# Altium schematic sheet 29-USB 2.0 INTERFACE.SchDoc
size 513 x 386 mm
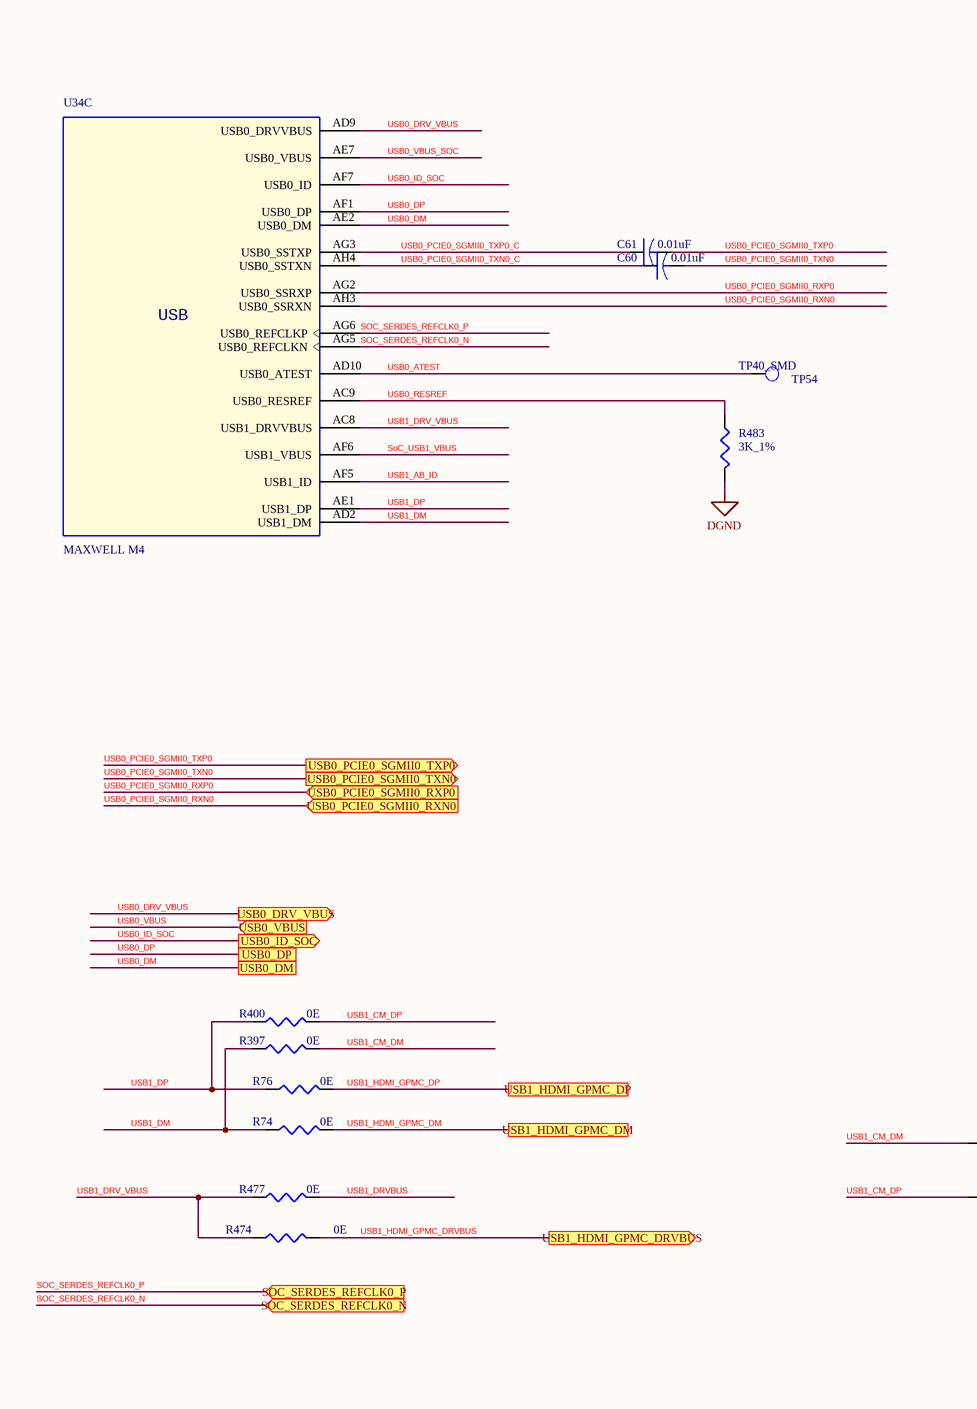
[diagram p0: 29-USB 2.0 INTERFACE.SchDoc, left]
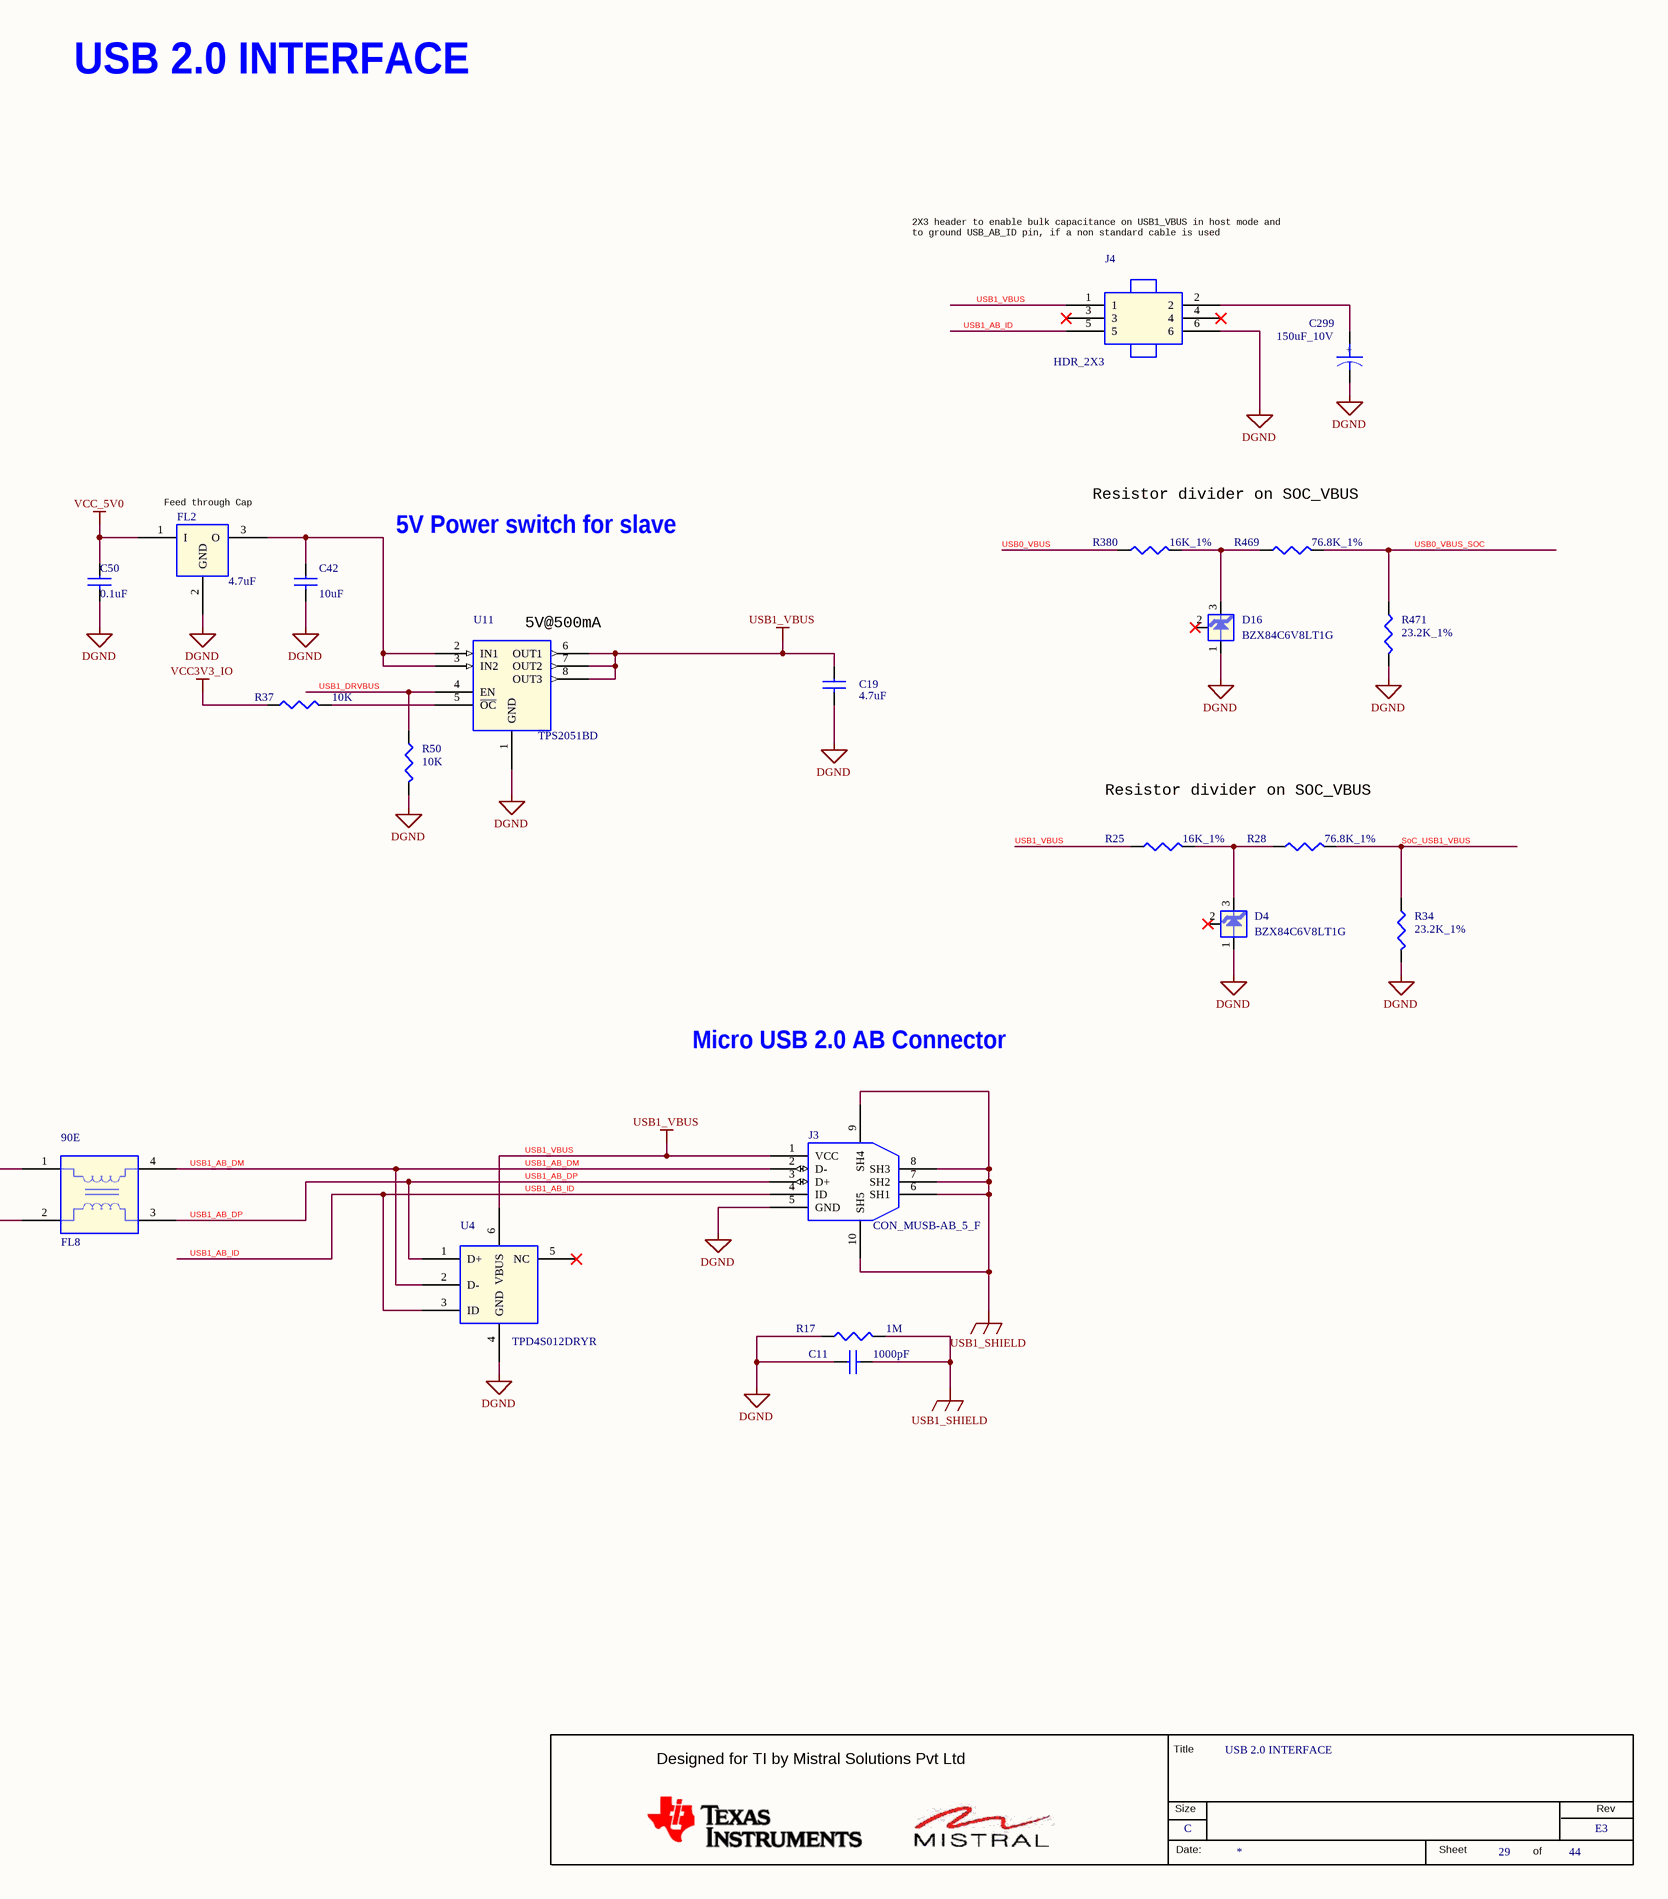
[diagram p1: 29-USB 2.0 INTERFACE.SchDoc, right]

## Parts
*  RevCode: E3  Title: USB 2.0 INTERFACE  Page Size: C  Page Number: 29  Page Count: 44  (hidden comment: MISTRAL_TITLEBLK_CSIZE)  (graphical)
C11  1000pF  [CAP1206]
C19  4.7uF  [CAP0402_0-75]
C42  10uF  [CAP0603_1]
C50  0.1uF  [CAP0201_0-5]
C60  0.01uF  [CAP0402_0-75]
C61  0.01uF  [CAP0402_0-75]
C299  150uF_10V  [CAPT7343D_3-25]
D4  BZX84C6V8LT1G  [SOT23-123_1-2]
D16  BZX84C6V8LT1G  [SOT23-123_1-2]
FL2  4.7uF  [EMIFIL_NFM21P_0805_1]
FL8  90E  [IND4_ACM2012_90X50_SMD_1-3]
J3  CON_MUSB-AB_5_F  [CON_USBAB5_475900001_S_R_S_3-1]
J4  HDR_2X3  [HDR_2X3_TSW-103-07-D_S_T_8-4]
R17  1M  [RES0603_0-75]
R25  16K_1%  [RES0402]
R28  76.8K_1%  [RES0402]
R34  23.2K_1%  [RES0402]
R37  10K  [RES0402_0-5]
R50  10K  [RES0402_0-5]
R74  0E  [RES0402_0-5]
R76  0E  [RES0402_0-5]
R380  16K_1%  [RES0402]
R397  0E  [RES0402_0-5]
R400  0E  [RES0402_0-5]
R469  76.8K_1%  [RES0402]
R471  23.2K_1%  [RES0402]
R474  0E  [RES0402_0-5]
R477  0E  [RES0402_0-5]
R483  3K_1%  [RES0402_0-5]
TP54  TP40_SMD  [TP40_SMD]
U4  TPD4S012DRYR  [SON6_19-68_40X60_PB_0-6]
U11  TPS2051BD  [SOIC8_1-8]
U34  MAXWELL M4  [BGA784_31-49_910X910_1-7]  (part C of 19)

## Ports
SOC_SERDES_REFCLK0_N (in), SOC_SERDES_REFCLK0_P (in), USB0_DM, USB0_DP, USB0_DRV_VBUS (out), USB0_ID_SOC (out), USB0_PCIE0_SGMII0_RXN0 (in), USB0_PCIE0_SGMII0_RXP0 (in), USB0_PCIE0_SGMII0_TXN0 (out), USB0_PCIE0_SGMII0_TXP0 (out), USB0_VBUS (in), USB1_HDMI_GPMC_DM, USB1_HDMI_GPMC_DP, USB1_HDMI_GPMC_DRVBUS (out)

## Nets
DGND: C11.1 C19.2 C42.2 C50.2 C299.2 D4.1(A) D16.1(A) FL2.2(GND) J3.5(GND) J4.6 R17.1 R34.2 R50.2 R471.2 R483.2 U4.4(GND) U11.1(GND)
USB1_SHIELD: C11.2 J3.6(SH1) J3.7(SH2) J3.8(SH3) J3.9(SH4) J3.10(SH5) R17.2
USB1_VBUS: C19.1 J3.1(VCC) J4.1 R25.1 U4.6(VBUS) U11.6(OUT1) U11.7(OUT2) U11.8(OUT3)
VCC3V3_IO: R37.1
VCC_5V0: C50.1 FL2.1(I)
SOC_SERDES_REFCLK0_N: U34.AG5(USB0_REFCLKN) ; port SOC_SERDES_REFCLK0_N
SOC_SERDES_REFCLK0_P: U34.AG6(USB0_REFCLKP) ; port SOC_SERDES_REFCLK0_P
SoC_USB1_VBUS: R28.2 R34.1 U34.AF6(USB1_VBUS)
USB0_ATEST: TP54.1(TP) U34.AD10(USB0_ATEST)
USB0_DM: U34.AE2(USB0_DM) ; port USB0_DM
USB0_DP: U34.AF1(USB0_DP) ; port USB0_DP
USB0_DRV_VBUS: U34.AD9(USB0_DRVVBUS) ; port USB0_DRV_VBUS
USB0_ID_SOC: U34.AF7(USB0_ID) ; port USB0_ID_SOC
USB0_PCIE0_SGMII0_RXN0: U34.AH3(USB0_SSRXN) ; port USB0_PCIE0_SGMII0_RXN0
USB0_PCIE0_SGMII0_RXP0: U34.AG2(USB0_SSRXP) ; port USB0_PCIE0_SGMII0_RXP0
USB0_PCIE0_SGMII0_TXN0: C60.2 ; port USB0_PCIE0_SGMII0_TXN0
USB0_PCIE0_SGMII0_TXN0_C: C60.1 U34.AH4(USB0_SSTXN)
USB0_PCIE0_SGMII0_TXP0: C61.2 ; port USB0_PCIE0_SGMII0_TXP0
USB0_PCIE0_SGMII0_TXP0_C: C61.1 U34.AG3(USB0_SSTXP)
USB0_RESREF: R483.1 U34.AC9(USB0_RESREF)
USB0_VBUS: R380.1 ; port USB0_VBUS
USB0_VBUS_SOC: R469.2 R471.1 U34.AE7(USB0_VBUS)
USB1_AB_DM: FL8.4 J3.2(D-) U4.2(D-)
USB1_AB_DP: FL8.3 J3.3(D+) U4.1(D+)
USB1_AB_ID: J3.4(ID) J4.5 U4.3(ID) U34.AF5(USB1_ID)
USB1_CM_DM: FL8.1 R397.2
USB1_CM_DP: FL8.2 R400.2
USB1_DM: R74.2 R397.1 U34.AD2(USB1_DM)
USB1_DP: R76.2 R400.1 U34.AE1(USB1_DP)
USB1_DRV_VBUS: R474.2 R477.1 U34.AC8(USB1_DRVVBUS)
USB1_DRVBUS: R50.1 R477.2 U11.4(EN)
USB1_HDMI_GPMC_DM: R74.1 ; port USB1_HDMI_GPMC_DM
USB1_HDMI_GPMC_DP: R76.1 ; port USB1_HDMI_GPMC_DP
USB1_HDMI_GPMC_DRVBUS: R474.1 ; port USB1_HDMI_GPMC_DRVBUS
NetC42_1: C42.1 FL2.3(O) U11.2(IN1) U11.3(IN2)
NetC299_1: C299.1 J4.2
NetD4_3: D4.3(C) R25.2 R28.1
NetD16_3: D16.3(C) R380.2 R469.1
NetR37_2: R37.2 U11.5(~{OC})

Not connected (* = marked no-connect by the designer): D4 2(NC)*; D16 2(NC)*; J4 3* 4*; U4 5(NC)*

## Notes on the sheet
- USB 2.0 INTERFACE
- 2X3 header to enable bulk capacitance on USB1_VBUS in host mode and
  to ground USB_AB_ID pin, if a non standard cable is used
- Resistor divider on SOC_VBUS
- (near FL2) Feed through Cap
- 5V Power switch for slave
- (near U11) 5V@500mA
- Micro USB 2.0 AB Connector
- (in symbol AM654X_BGA784, part C) USB
- (in symbol CAP_POL) +
- (in symbol MISTRAL_TITLEBLK_CSIZE) Title; Designed for TI by Mistral Solutions Pvt Ltd; Size; Rev; Date:; Sheet; of

## Library data of the parts
* = MISTRAL_TITLEBLK_CSIZE: Issue: 1.0; Page Create Date: March  8, 1995; Page Modify Date: *
C11 = CAP_Dup5: CAP CERAMIC 1000pF 2KV 10% X7R 1206; Part_type: CAPACITORS\CERAMIC; Mfr_part_number: 1206GC102KAT1A; Mfr_name: AVX CORPORATION; Mistral Part No: 120009030147-R; Custom_Duty: 15%; Customs_HS_Code: 85322990; Project: ADR1B; Chkd/date: SHREESHAIL/291106; Crtd /date: MAZHAR/281106; Datasheet: Y:\MIS_DATABASE\DATASHEETS\CAPACITORS\AVX_MLC.PDF; Temperature: -55°C+125°C; Weight: NA; Height: 1.50MM; Distributor_part_number: 478-2956-1-ND; Distributor_name: DIGIKEY; Package: 1206; Voltage: 2KV; Tolerance: 10%; PCB Footprint: CAP1206; Library Ref: CAP; Footprint Ref: CAP1206; Library Path: Y:\MIS_DATABASE\Library\ALTIUM_TOOL\SCHEMATICS_PARTS\MS_DISCRETE_Library.schlib; Footprint Path: Y:\MIS_DATABASE\Library\ALTIUM_TOOL\PCB_FOOTPRINTS\Altium_Footprint_Lib.PcbLib
C19 = CAP_Dup5: CAP CERAMIC 4.7uF 10V 20% X5R 0402; Mistral Part No: 120012060002-R; Mfr_name: AVX CORPORATION; Mfr_part_number: 0402ZD475MAT2A; Part_type: CAPACITORS\CERAMIC; Project: TI_MAXIE_CPB; Wattage: NA; Customs_HS_Code: 85322990; Custom_Duty: 15%; Tolerance: 20%; Voltage: 10V; Package: 0402; Distributor_name: DIGIKEY; Distributor_part_number: 478-10791-1-ND; Height: 0.71MM; Weight: 0.65mg; Temperature: -55°C+85°C; Datasheet: Y:\MIS_DATABASE\DATASHEETS\CAPACITORS\AVX_MLC.PDF; Crtd /date: MANIRAJA/230118; Chkd/date: MANIRAJA/230118; MECHANICAL 3D STEP FILE: CAP0402_0-75; PCB Footprint: CAP0402_0-75; Library Ref: CAP
C42 = CAP_Dup5: CAP CERAMIC 10uF 10V 10% X5R 0603; Part_type: CAPACITORS\CERAMIC; Mfr_part_number: 0603ZD106KAT2A; Mfr_name: AVX CORPORATION; Mistral Part No: 120010080001-R; Wattage: NA; Custom_Duty: 15%; Customs_HS_Code: 85322990; Project: TI_MAXIE_CPB; MECHANICAL 3D STEP FILE: CAP0603_1; Temperature: -55°C+85°C; Weight: 2mg; Chkd/date: MANIRAJA/230118; Crtd /date: MANIRAJA/230118; Datasheet: Y:\MIS_DATABASE\DATASHEETS\CAPACITORS\AVX_MLC.PDF; Height: 0.94MM; Distributor_part_number: 478-10766-1-ND; Distributor_name: DIGIKEY; Package: 0603; Voltage: 10V; Tolerance: 10%; PCB Footprint: CAP0603_1; Library Ref: CAP
C50 = CAP_Dup5: CAP CERAMIC 0.1uF 16V 10% X5R 0201; Mistral Part No: 120009030072-R; Mfr_name: MURATA; Mfr_part_number: GRM033R61C104KE84J; Part_type: CAPACITORS\CERAMIC; Project: TI_MAXIE_CPB; Wattage: NA; Customs_HS_Code: 85322990; Custom_Duty: 15%; Tolerance: 10%; Voltage: 16V; Package: 0201; Distributor_name: DIGIKEY; Distributor_part_number: 490-16742-1-ND; Height: 0.33MM; Weight: 0.33mg; Temperature: -55°C+85°C; Datasheet: Y:\MIS_DATABASE\DATASHEETS\CAPACITORS\GRM033R61C104KE84.PDF; Crtd /date: MANIRAJA/120218; Chkd/date: MANIRAJA/120218; MECHANICAL 3D STEP FILE: CAP0201_0-5; PCB Footprint: CAP0201_0-5; Library Ref: CAP
C60 = CAP: CAP CERAMIC 0.01uF 10V 10% X7R 0402; Mistral Part No: 120009030017-R; Mfr_name: AVX CORPORATION; Mfr_part_number: 0402ZC103KAT2A; Part_type: CAPACITORS\CERAMIC; Project: ADR; Wattage: NA; Customs_HS_Code: 85322990; Custom_Duty: 15%; PCB Footprint: CAP0402_0-75; Tolerance: 10%; Voltage: 10V; Package: 0402; Distributor_name: DIGIKEY; Distributor_part_number: 478-7890-1-ND; Library Ref: CAP; Height: 0.56MM; Weight: 0.65mg; Temperature: -55°C+125°C; Datasheet: Y:\MIS_DATABASE\DATASHEETS\CAPACITORS\AVX_MLC.PDF; Crtd /date: MAZHAR/201005; Chkd/date: VASANTHA/061216; MECHANICAL 3D STEP FILE: CAP0402_0-75
C61 = CAP: CAP CERAMIC 0.01uF 10V 10% X7R 0402; Part_type: CAPACITORS\CERAMIC; Mfr_part_number: 0402ZC103KAT2A; Mfr_name: AVX CORPORATION; Mistral Part No: 120009030017-R; Custom_Duty: 15%; Customs_HS_Code: 85322990; Wattage: NA; Project: ADR; PCB Footprint: CAP0402_0-75; MECHANICAL 3D STEP FILE: CAP0402_0-75; Chkd/date: VASANTHA/061216; Crtd /date: MAZHAR/201005; Datasheet: Y:\MIS_DATABASE\DATASHEETS\CAPACITORS\AVX_MLC.PDF; Temperature: -55°C+125°C; Weight: 0.65mg; Height: 0.56MM; Library Ref: CAP; Distributor_part_number: 478-7890-1-ND; Distributor_name: DIGIKEY; Package: 0402; Voltage: 10V; Tolerance: 10%
C299 = CAP_POL: CAP TANTALUM 150uF 10V 10% ESR 0.9E D7373; Part_type: CAPACITORS\TANTALUM; Mfr_part_number: TAJD157K010TNJV; Mfr_name: AVX CORPORATION; Mistral Part No: 120018010025-R; Custom_Duty: 15%; Customs_HS_Code: 85322990; Wattage: NA; Project: TI_MAXIE_CPB; MECHANICAL 3D STEP FILE: CAPT7343D_3-25; Chkd/date: MANIRAJA/240118; Crtd /date: MANIRAJA/240118; Datasheet: Y:\MIS_DATABASE\DATASHEETS\CAPACITORS\TAJD156.PDF; Temperature: -55°C+125°C; Weight: NA; Height: 3.10MM; Distributor_part_number: 478-11241-1-ND; Distributor_name: DIGIKEY; Package: D7373; Voltage: 10V; Tolerance: 10%; PCB Footprint: CAPT7343D_3-25; Library Ref: CAP_POL
D4 D16 = DIODE_ZENER_SOT23_13: DIODE ZENER 250mW 6.8V SOT23-123; Mistral Part No: 130017100002-R; Mfr_name: ON SEMICONDUCTOR; Part_type: DIODE\ZENER; Project: TI_MAXIE_CPB; Tolerance: NA; Customs_HS_Code: 85412900; Custom_Duty: 15%; Mfr_part_number: BZX84C6V8LT1G; Voltage: 6.8V; Wattage: NA; Package: SOT23-123; Distributor_name: DIGIKEY; Distributor_part_number: BZX84C6V8LT1GOSCT-ND; Height: 1.11MM; Weight: 8mg; Temperature: -65°C+150°C; Datasheet: Y:\MIS_DATABASE\DATASHEETS\DISCRETES\DIODES\BZX84XX.PDF; Crtd /date: MANIRAJA/031017; Chkd/date: MANIRAJA/031017; MECHANICAL 3D STEP FILE: SOT23-123_1-2; PCB Footprint: SOT23-123_1-2; Library Ref: DIODE_ZENER_SOT23_13
FL2 = EMI_FILTER: PASSIVE FILTER EMI 4.7uF 0805-3; Part_type: MISC\FILTER; Mfr_part_number: NFM21PC475B1A3; Mfr_name: MURATA; Mistral Part No: 130009060011; Custom_Duty: 24%; Customs_HS_Code: 85437099; Wattage: NA; Project: AXON; MECHANICAL 3D STEP FILE: EMIFIL_NFM21P_0805_1; Chkd/date: VASANTHA/191216; Crtd /date: USMAN/200409; Datasheet: Y:\MIS_DATABASE\DATASHEETS\DISCRETES\INDUCTORS\NFM21P.PDF; Temperature: -40°C+85°C; Weight: NA; Height: 0.95MM; Distributor_part_number: NA; Distributor_name: NA; Package: 0805; Voltage: NA; Tolerance: NA; PCB Footprint: EMIFIL_NFM21P_0805_1; Library Ref: EMI_FILTER
FL8 = EMIFILTER_ACM: PASSIVE FILTER COMMON MODE 90E 400mA SMD; Mfr_part_number: ACM2012-900-2P-T002; Mfr_name: TDK CORPORATION; Mistral Part No: 130009030803-R; Custom_Duty: 24%; Customs_HS_Code: 85437099; Project: SMART VIEW_NVR; Tolerance: NA; Chkd/date: MANIRAJA/130218; Crtd /date: MAZHAR/270907; Datasheet: Y:\MIS_DATABASE\DATASHEETS\ICS\MISC\ACM2012-SER.PDF; Height: 1.30MM; Distributor_part_number: 445-2207-1-ND; Distributor_name: DIGIKEY; Package: SMD; Part_type: FILTER; Voltage: NA; Wattage: NA; Library Ref: EMIFILTER_ACM; PCB Footprint: IND4_ACM2012_90X50_SMD_1-3; Weight: 5.5mg; Temperature: -40°C+85°C; MECHANICAL 3D STEP FILE: IND4_ACM2012_90X50_SMD_1-3
J3 = CON_USB_MINI-AB_10: CON MICRO USB-AB TYPE 5POS FEMALE RT SMD; Part_type: CONNECTOR\USB; Mfr_part_number: 475900001; Mfr_name: MOLEX; Mistral Part No: 150009090024-R; Custom_Duty: 24%; Customs_HS_Code: 85369090; Wattage: NA; Project: GOLDEN-I; MECHANICAL 3D STEP FILE: CON_USBAB5_475900001_S_R_S_3-1; RoHS: NA; Chkd/date: VASANTHA/060117; Crtd /date: MAZHAR/290909; Datasheet: Y:\MIS_DATABASE\DATASHEETS\CONNECTORS\475900.PDF; Temperature: -30°C+85°C; Weight: NA; Height: 3.10MM; Distributor_part_number: WM17144CT-ND; Distributor_name: DIGIKEY; Package: SMD; Voltage: NA; Tolerance: NA; PCB Footprint: CON_USBAB5_475900001_S_R_S_3-1; Library Ref: CON_USB_MINI-AB_10
J4 = HEADER_3X2: CON HDR 2X3 2.54MM PITCH ST TH; Mistral Part No: 150018010019-R; Mfr_name: SAMTEC; Mfr_part_number: TSW-103-07-T-D; Part_type: CONNECTOR\HEADERS; OCT Option: G; Project: TI_MAXIE_CPB; Tolerance: NA; Customs_HS_Code: 85369090; Custom_Duty: 24%; PCB Footprint: HDR_2X3_TSW-103-07-D_S_T_8-4; Voltage: NA; Wattage: NA; Package: THRU-HOLE; Distributor_name: DIGIKEY; Distributor_part_number: SAM1034-03-ND; Height: 8.38MM; Weight: NA; Temperature: -55°C+105°C; Datasheet: Y:\MIS_DATABASE\DATASHEETS\CONNECTORS\TSW-MK.PDF; Crtd /date: MANIRAJA/220118; Chkd/date: MANIRAJA/230118; MECHANICAL 3D STEP FILE: HDR_2X3_TSW-103-07-D_S_T_8-4; Library Ref: HEADER_3X2
R17 = RESISTOR_Dup5: RES 1M 1/10W 5% 0603; Part_type: RESISTORS\FIXED; Mfr_part_number: ERJ-3GEYJ105V; Mfr_name: PANASONIC-ECG; Mistral Part No: 110009030413-R; Custom_Duty: 15%; Customs_HS_Code: 85332119; Voltage: NA; Project: BSN; MECHANICAL 3D STEP FILE: RES0603_0-75; Chkd/date: VASANTHA/060217; Crtd /date: USMAN/111207; Datasheet: Y:\MIS_DATABASE\DATASHEETS\RESISTORS\PAN-ERJ-3GE.PDF; Temperature: -55°C+155°C; Weight: 2mg; Height: 0.55MM; Distributor_part_number: P1.0MGCT-ND; Distributor_name: DIGIKEY; Package: 0603; Wattage: 1/10W; Tolerance: 5%; PCB Footprint: RES0603_0-75; Library Ref: RESISTOR
R25 R380 = RESISTOR_Dup5: RES 16K 1/16W 1% 0402; Mistral Part No: 110011030003-R; Mfr_name: ROHM; Mfr_part_number: MCR01MRTF1602; Part_type: RESISTORS\FIXED; Project: TMDXCSKCC; Voltage: NA; Customs_HS_Code: 85332119; Custom_Duty: 15%; Tolerance: 1%; Wattage: 1/16W; Package: 0402; Distributor_name: DIGIKEY; Distributor_part_number: RHM16KCDCT-ND; Height: 0.40MM; Weight: NA; Temperature: -55°C+155°C; Datasheet: Y:\MIS_DATABASE\DATASHEETS\RESISTORS\MCR01MRTF1211.PDF; Crtd /date: VASANTHA/040616; Chkd/date: VASANTHA/040616; PCB Footprint: RES0402; Library Ref: RESISTOR
R28 R469 = RESISTOR_Dup5: RES 76.8K 1/16W 1% 0402; Part_type: RESISTORS\FIXED; Mfr_part_number: RC0402FR-0776K8L; Mfr_name: YAGEO AMERICA; Mistral Part No: 110016060005-R; Custom_Duty: 15%; Customs_HS_Code: 85332119; Voltage: NA; Project: TMDXCSKCC; Chkd/date: VASANTHA/140616; Crtd /date: VASANTHA/140616; Datasheet: Y:\MIS_DATABASE\DATASHEETS\RESISTORS\YAGEO-RC0402.PDF; Temperature: -55°C+155°C; Weight: NA; Height: 0.55MM; Distributor_part_number: YAG3230CT-ND; Distributor_name: DIGIKEY; Package: 0402; Wattage: 1/16W; Tolerance: 1%; PCB Footprint: RES0402; Library Ref: RESISTOR
R34 R471 = RESISTOR_Dup5: RES 23.2K 1/16W 1% 0402; Mistral Part No: 110015080017-R; Mfr_name: VISHAY; Mfr_part_number: CRCW040223K2FKED; Part_type: RESISTORS\FIXED; Cust_part_number: 4700-80154E; Project: OCTASIC_3000; Voltage: NA; Customs_HS_Code: 85332119; Custom_Duty: 15%; Tolerance: 1%; Wattage: 1/16W; Package: 0402; Distributor_name: DIGIKEY; Distributor_part_number: 541-23.2KLCT-ND; Height: 0.40MM; Weight: NA; Temperature: -55°C+155°C; Datasheet: Y:\MIS_DATABASE\DATASHEETS\RESISTORS\CRCW0603.PDF; Crtd /date: JEBRAN/110815; Chkd/date: JEBRAN/110815; PCB Footprint: RES0402; Library Ref: RESISTOR
R37 = RESISTOR_Dup5: RES 10K 1/16W 5% 0402; Part_type: RESISTORS\FIXED; Mfr_part_number: RC0402JR-0710KL; Mfr_name: YAGEO AMERICA; Mistral Part No: 110009030208-R; Custom_Duty: 15%; Customs_HS_Code: 85332119; Voltage: NA; Project: HSE; MECHANICAL 3D STEP FILE: RES0402_0-5; RoHS: Pb-Free; Chkd/date: VASANTHA/061216; Crtd /date: MAZHAR/230805; Datasheet: Y:\MIS_DATABASE\DATASHEETS\RESISTORS\YAGEO-RC0402.PDF; Temperature: -55°C+155°C; Weight: 0.65mg; Height: 0.40MM; Distributor_part_number: 311-10KJRCT-ND; Distributor_name: DIGIKEY; Package: 0402; Wattage: 1/16W; Tolerance: 5%; PCB Footprint: RES0402_0-5; Library Ref: RESISTOR; Footprint Ref: RES0402_0-5; Library Path: Y:\MIS_DATABASE\Library\ALTIUM_TOOL\SCHEMATICS_PARTS\MS_DISCRETE_Library.schlib; Footprint Path: Y:\MIS_DATABASE\Library\ALTIUM_TOOL\PCB_FOOTPRINTS\Altium_Footprint_Lib.PcbLib
R50 = RESISTOR_Dup5: RES 10K 1/16W 5% 0402; Mistral Part No: 110009030208-R; Mfr_name: YAGEO AMERICA; Mfr_part_number: RC0402JR-0710KL; Part_type: RESISTORS\FIXED; Project: HSE; Voltage: NA; Customs_HS_Code: 85332119; Custom_Duty: 15%; Tolerance: 5%; Wattage: 1/16W; Package: 0402; Distributor_name: DIGIKEY; Distributor_part_number: 311-10KJRCT-ND; Height: 0.40MM; Weight: 0.65mg; Temperature: -55°C+155°C; Datasheet: Y:\MIS_DATABASE\DATASHEETS\RESISTORS\YAGEO-RC0402.PDF; Crtd /date: MAZHAR/230805; Chkd/date: VASANTHA/061216; RoHS: Pb-Free; MECHANICAL 3D STEP FILE: RES0402_0-5; PCB Footprint: RES0402_0-5; Library Ref: RESISTOR; Footprint Ref: RES0402_0-5; Library Path: Y:\MIS_DATABASE\Library\ALTIUM_TOOL\SCHEMATICS_PARTS\MS_DISCRETE_Library.schlib; Footprint Path: Y:\MIS_DATABASE\Library\ALTIUM_TOOL\PCB_FOOTPRINTS\Altium_Footprint_Lib.PcbLib
R74 R474 = RESISTOR_Dup5: RES 0E 1/16W 0402; Part_type: RESISTORS\FIXED; Mfr_part_number: CRCW04020000Z0ED; Mfr_name: VISHAY; Mistral Part No: 110010080019-P; Custom_Duty: 15%; Customs_HS_Code: 85332119; Voltage: NA; Project: PB_BUGBASE; NI_MARK: DNI; PCB Footprint: RES0402_0-5; MECHANICAL 3D STEP FILE: RES0402_0-5; RoHS: Pb-Free; Chkd/date: VASANTHA/201216; Crtd /date: MUDDU/190810; Datasheet: Y:\MIS_DATABASE\DATASHEETS\RESISTORS\CRCW0603.PDF; Temperature: -55°C+155°C; Weight: 0.65g/1000pcs; Height: 0.40MM; Distributor_part_number: 541-0.0JCT-ND; Distributor_name: DIGIKEY; Package: 0402; Wattage: 1/16W; Tolerance: NA; Library Ref: RESISTOR; Footprint Ref: RES0402_0-5; Library Path: Y:\MIS_DATABASE\Library\ALTIUM_TOOL\SCHEMATICS_PARTS\MS_DISCRETE_Library.schlib; Footprint Path: Y:\MIS_DATABASE\Library\ALTIUM_TOOL\PCB_FOOTPRINTS\Altium_Footprint_Lib.PcbLib
R76 = RESISTOR_Dup5: RES 0E 1/16W 0402; Part_type: RESISTORS\FIXED; Mfr_part_number: CRCW04020000Z0ED; Mfr_name: VISHAY; Mistral Part No: 110010080019-P; Custom_Duty: 15%; Customs_HS_Code: 85332119; Voltage: NA; Project: PB_BUGBASE; PCB Footprint: RES0402_0-5; MECHANICAL 3D STEP FILE: RES0402_0-5; RoHS: Pb-Free; Chkd/date: VASANTHA/201216; Crtd /date: MUDDU/190810; Datasheet: Y:\MIS_DATABASE\DATASHEETS\RESISTORS\CRCW0603.PDF; Temperature: -55°C+155°C; Weight: 0.65g/1000pcs; Height: 0.40MM; Distributor_part_number: 541-0.0JCT-ND; Distributor_name: DIGIKEY; Package: 0402; Wattage: 1/16W; Tolerance: NA; Library Ref: RESISTOR; Footprint Ref: RES0402_0-5; Library Path: Y:\MIS_DATABASE\Library\ALTIUM_TOOL\SCHEMATICS_PARTS\MS_DISCRETE_Library.schlib; Footprint Path: Y:\MIS_DATABASE\Library\ALTIUM_TOOL\PCB_FOOTPRINTS\Altium_Footprint_Lib.PcbLib
R397 R400 R477 = RESISTOR_Dup4: RES 0E 1/16W 0402; Part_type: RESISTORS\FIXED; Mfr_part_number: CRCW04020000Z0ED; Mfr_name: VISHAY; Mistral Part No: 110010080019-P; Custom_Duty: 15%; Customs_HS_Code: 85332119; Voltage: NA; Project: PB_BUGBASE; PCB Footprint: RES0402_0-5; RoHS: Pb-Free; Chkd/date: VASANTHA/201216; Crtd /date: MUDDU/190810; Datasheet: Y:\MIS_DATABASE\DATASHEETS\RESISTORS\CRCW0603.PDF; Temperature: -55°C+155°C; Weight: 0.65g/1000pcs; Height: 0.40MM; Distributor_part_number: 541-0.0JCT-ND; Distributor_name: DIGIKEY; Package: 0402; Wattage: 1/16W; Tolerance: NA; MECHANICAL 3D STEP FILE: RES0402_0-5; Library Ref: RESISTOR; Footprint Ref: RES0402_0-5; Library Path: Y:\MIS_DATABASE\Library\ALTIUM_TOOL\SCHEMATICS_PARTS\MS_DISCRETE_Library.schlib; Footprint Path: Y:\MIS_DATABASE\Library\ALTIUM_TOOL\PCB_FOOTPRINTS\Altium_Footprint_Lib.PcbLib
R483 = RESISTOR_Dup5: RES 3K 1/16W 1% 0402; Part_type: RESISTORS\FIXED; Mfr_part_number: RC0402FR-073KL; Mfr_name: YAGEO AMERICA; Mistral Part No: 110017110004-R; Custom_Duty: 15%; Customs_HS_Code: 85332119; Voltage: NA; Project: TI_SVB_MAXWELL_DUT; MECHANICAL 3D STEP FILE: RES0402_0-5; Chkd/date: MANIRAJA/101117; Crtd /date: MANIRAJA/101117; Datasheet: Y:\MIS_DATABASE\DATASHEETS\RESISTORS\YAGEO.PDF; Temperature: -55°C+155°C; Weight: 0.65mg; Height: 0.40MM; Distributor_part_number: 311-3KLRCT-ND; Distributor_name: DIGIKEY; Package: 0402; Wattage: 1/16W; Tolerance: 1%; PCB Footprint: RES0402_0-5; Library Ref: RESISTOR
TP54 = TESTPOINT: TESTPOINT CIR 40 SMD; Mfr_name: LOCAL; Mistral Part No: 130009030933; Project: RAINIER-3; Tolerance: NA; NI_MARK: DNI; Chkd/date: MAZHAR/190505; Crtd /date: MAZHAR/190505; Height: NA; Distributor_part_number: NA; Distributor_name: NA; Package: SMD; Part_type: TESTPOINT; Mfr_part_number: TP40_SMD; Voltage: NA; Wattage: NA; Weight: NA; Temperature: NA; Datasheet: NA; MECHANICAL 3D STEP FILE: NA; Library Path: Y:\MIS_DATABASE\Library\ALTIUM_TOOL\SCHEMATICS_PARTS\MS_DISCRETE_Library.schlib; Footprint Path: Y:\MIS_DATABASE\Library\ALTIUM_TOOL\PCB_FOOTPRINTS\Altium_Footprint_Lib.PcbLib; PCB Footprint: TP40_SMD; Library Ref: TESTPOINT; Footprint Ref: TP40_SMD; RoHS: NA
U4 = TPD4S012DRY_SON6: IC 4CH ESD SOLUTION SON6; Part_type: ICS\INTERFACE; Mfr_name: TEXAS INSTRUMENTS; Mistral Part No: 141011080022-R; Custom_Duty: 15%; Customs_HS_Code: 85423100; Wattage: NA; Project: ACRO_DM3730; MECHANICAL 3D STEP FILE: SON6_19-68_40X60_PB_0-6; Chkd/date: VASANTHA/060117; Crtd /date: BAVISH/190811; Datasheet: Y:\MIS_DATABASE\DATASHEETS\ICS\INTERFACE\TPD4S012.PDF; Temperature: -40°C+85°C; Weight: NA; Height: 0.60MM; Distributor_part_number: 296-24244-1-ND; Distributor_name: DIGIKEY; Package: SON6; Voltage: NA; Tolerance: NA; Mfr_part_number: TPD4S012DRYR; PCB Footprint: SON6_19-68_40X60_PB_0-6; Library Ref: TPD4S012DRY_SON6
U11 = TPS2051BD_SOIC8: IC POWER DISTRIBUTION SWITCH SOIC8; Part_type: ICS\POWER; Mfr_name: TEXAS INSTRUMENTS; Mistral Part No: 142014060011-R; Custom_Duty: 15%; Customs_HS_Code: 85423100; Wattage: NA; Project: AEGIS_POM; Chkd/date: NAVEED/150714; Crtd /date: VASANTHA/190614; Datasheet: Y:\MIS_DATABASE\DATASHEETS\MISC\REGULATORS\TPS2051BDBVR.PDF; Temperature: -40°C+125°C; Weight: 72.6mg; Height: 1.75MM; Distributor_part_number: 296-26911-5-ND; Distributor_name: DIGIKEY; Package: SOIC8; Voltage: NA; Tolerance: NA; Mfr_part_number: TPS2051BD; Library Ref: TPS2051BD_SOIC8; Footprint Ref: SOIC8_1-8; PCB Footprint: SOIC8_1-8; MECHANICAL 3D STEP FILE: SOIC8_1-8; Library Path: Y:\MIS_DATABASE\Library\ALTIUM_TOOL\SCHEMATICS_PARTS\MS_MISCPOWER_Library.schlib; Footprint Path: Y:\MIS_DATABASE\Library\ALTIUM_TOOL\PCB_FOOTPRINTS\Altium_Footprint_Lib.PcbLib
U34 = AM654X_BGA784: IC MAXWELL MICRO CONTROLLER UNIT BGA784; Part_type: ICS\DIGITAL\MICROCONTROLLER; Mfr_part_number: MAXWELL M4_EVM; Mfr_name: TEXAS INSTRUMENTS; Mistral Part No: 141217100003; Custom_Duty: 15%; Customs_HS_Code: 85423100; Wattage: NA; Project: TI_MAXIE_CPB; PCB Footprint: BGA784_31-49_910X910_1-7; MECHANICAL 3D STEP FILE: BGA784_31-49_910X910_1-7; Chkd/date: MANIRAJA/130717; Crtd /date: MANIRAJA/130717; Datasheet: Y:\MIS_DATABASE\DATASHEETS\ICS\DIGITAL\MICROCONTROLLER\MAXWELLM4.PDF; Temperature: NA; Weight: NA; Height: 1.63MM; Distributor_part_number: NA; Distributor_name: NA; Package: BGA784; Voltage: NA; Tolerance: NA; Library Ref: AM654X_BGA784